# Altium schematic sheet CANsetup.SchDoc
size A4
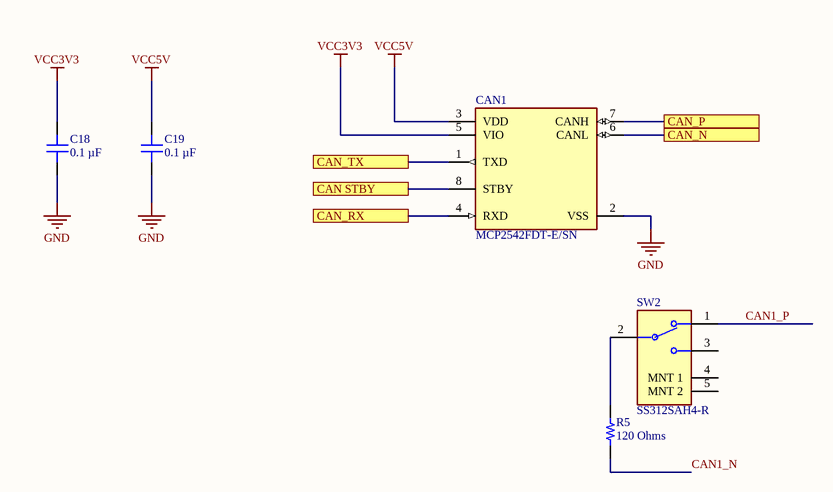
[diagram p0: CANsetup.SchDoc]

## Parts
C18  0.1 µF  [CAP 01005_0402]
C19  0.1 µF  [CAP 01005_0402]
CAN1  MCP2542FDT-E/SN  [FP-C04-057-SN-IPC_C]
R5  120 Ohms  [RES 0201_0603]
SW2  SS312SAH4-R  [FP-SS312SAH4-R-MFG]

## Ports
CAN STBY, CAN_N, CAN_P, CAN_RX, CAN_TX

## Nets
GND: C18.2 C19.2 CAN1.2(VSS)
VCC3V3: C18.1 CAN1.5(VIO)
VCC5V: C19.1 CAN1.3(VDD)
CAN1_N: R5.2
CAN1_P: SW2.1
CAN STBY: CAN1.8(STBY) ; port CAN STBY
CAN_N: CAN1.6(CANL) ; port CAN_N
CAN_P: CAN1.7(CANH) ; port CAN_P
CAN_RX: CAN1.4(RXD) ; port CAN_RX
CAN_TX: CAN1.1(TXD) ; port CAN_TX
NetR5_1: R5.1 SW2.2(COM)

Not connected (* = marked no-connect by the designer): SW2 3 4(MNT_1) 5(MNT_2)

## Library data of the parts
C18 C19 = CL02A104KQ2NNNC: CAP CER 0.1UF 6.3V X5R 01005; manufacturer: Samsung Electro-Mechanics; Tolerance: ±10%; Part Number: CL02A104KQ2NNNC; Value: 0.1 µF; Applications: General Purpose; Capacitance: 0.1 µF; componentlink1description: Datasheet; componentlink1url: http://www.samsungsem.com/kr/support/product-search/mlcc/CL02A104KQ2NNNC.jsp; componentlink2description: DigiKey Link; componentlink2url: https://www.digikey.com/en/products/detail/samsung-electro-mechanics/CL02A104KQ2NNNC/3886867; Device Package: 01005 (0402 Metric); lastupdated: 2023-11-30 9:46:05 PM; Lifecycle Status: Active; Minimum Order: 1; Mounting Type: Surface Mount, MLCC; Operating Temperature: -55°C ~ 85°C; Package / Case: 01005 (0402 Metric); packaging: TapeAndReel; Part Status: Active; price: 0.02; series: CL; Size / Dimension: 0.016" L x 0.008" W (0.40mm x 0.20mm); Supplier 1: DigiKey; Supplier Part Number 1: 1276-1209-1-ND; Temperature Coefficient: X5R; Thickness (Max): 0.009" (0.22mm); Voltage - Rated: 6.3V
CAN1 = CMP-06279-000006-1: IC TRANSCEIVER 1/1 8SOIC; Data Rate: 8Mbps; Receiver Hysteresis: 200mV; Min Operating Temperature: -40°C; Mount: Surface Mount; Case/Package: SOIC; Max Operating Temperature: 125°C; Packaging: Rail/Tube
R5 = RMCF0201JT120R: RES 120 OHM 5% 1/20W 0201; Manufacturer: Stackpole Electronics Inc; Power (Watts): 0.05W, 1/20W; Temperature Coefficient: ±200ppm/°C; Part Number: RMCF0201JT120R; Value: 120 Ohms; ComponentLink1Description: Datasheet; ComponentLink1URL: https://www.seielect.com/catalog/sei-rmcf_rmcp.pdf; ComponentLink2Description: DigiKey Link; ComponentLink2URL: https://www.digikey.com/en/products/detail/stackpole-electronics-inc/RMCF0201JT120R/5966040; Composition: Thick Film; Device Package: 0201 (0603 Metric); Height - Seated (Max): 0.010" (0.26mm); LastUpdated: 2023-11-30 8:20:29 PM; Lifecycle Status: Active; Minimum Order: 1; Number of Terminations: 2; Operating Temperature: -55°C ~ 155°C; Package / Case: 0201 (0603 Metric); Packaging: CutTape; PartId: 197; Part Status: Active; Price: 0.01; Ratings: AEC-Q200; Resistance: 120 Ohms; Series: RMCF; Size / Dimension: 0.024" L x 0.012" W (0.60mm x 0.30mm); Supplier 1: DigiKey; Supplier Part Number 1: 738-RMCF0201JT120RCT-ND; Supplier Device Package: 0201; Tolerance: ±5%
SW2 = CMP-31746-000001-1: SWITCH SLIDE SPDT 0.4VA 28V; Mechanical Life: 10000Cycles; Switch Function: On-On; Actuator Length: 2mm; Contact Style: Shorting; Max Current Rating: 100mA; Actuator Type: Standard; Actuator Material: Polyphenylene; Length: 10.5mm; Orientation: Right Angle; Voltage Rating (DC): 28V; Contact Material: Bronze; Electrical Life: 10000Cycles; Max Operating Temperature: 85°C; Case/Package: SMD/SMT; Depth: 7.45mm; Contact Plating: Gold; Voltage Rating (AC): 28V; Package Quantity: 1; Min Operating Temperature: -25°C; Switch Travel: 2mm; Housing Material: Bronze; RoHS Compliant: Yes; Lead Free: Lead Free; Termination: Gull Wing; Packaging: Tape and Reel; REACH SVHC: No SVHC; Mount: Surface Mount; Series: SS3; Throw Configuration: SPDT; Max Voltage Rating (AC): 28V; Max Voltage Rating (DC): 28V